# Altium project BuckConverter.PrjPcb
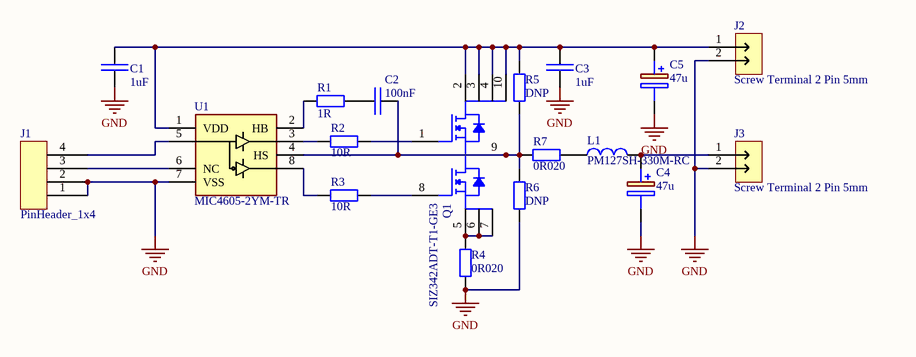
[diagram p0: BuckConverter.SchDoc]
1 sheet, 18 parts. Net scope: global (net labels, ports and power ports of the same name join across sheets).
Board file: PCB1.PcbDoc

## Sheet BuckConverter.SchDoc
size A4; SheetNumber: 1; SheetTotal: 1

### Parts
C1  1uF  [CAP_SM0805_YAGEOCC2_N]
C2  100nF  [CAP_SM0603_YAGEOCC2_N]
C3  1uF  [CAP_SM0805_YAGEOCC2_N]
C4  47u  [CAPAE7366X61N]
C5  47u  [CAPAE7366X61N]
J1  PinHeader_1x4  [PinHeader_1x4_2.54mm]
J2  Screw Terminal 2 Pin 5mm  [TB00250002BE]
J3  Screw Terminal 2 Pin 5mm  [TB00250002BE]
L1  PM127SH-330M-RC  [PM127SH330MRC]
Q1  SIZ342ADT-T1-GE3  [SIZ342ADT-T1-GE3]
R1  1R  [RES_SM0603_YAGEORC_N]
R2  10R  [RES_SM0603_YAGEORC_N]
R3  10R  [RES_SM0603_YAGEORC_N]
R4  0R020  [MSMA2512R0200FGN]
R5  DNP  [RES_SM0603_YAGEORC_N]
R6  DNP  [RES_SM0603_YAGEORC_N]
R7  0R020  [MSMA2512R0200FGN]
U1  MIC4605-2YM-TR  [SOIC127P600X163-8N]

### Nets
GND: C1.2 C3.2 C4.2(-) C5.2(-) J1.1 J1.2 J2.2 J3.2 R4.1 R6.1 U1.7(VSS)
NetC1_1: C1.1 C3.1 C5.1(+) J2.1 Q1.2(D) Q1.3(D) Q1.4(D) Q1.10(D) R5.2 U1.1(VDD)
NetC2_1: C2.1 R1.2
NetC2_2: C2.2 Q1.9(D) R5.1 R6.2 R7.2 U1.4(HS)
NetC4_1: C4.1(+) J3.1 L1.2
NetJ1_3: J1.3 U1.6(NC)
NetJ1_4: J1.4 U1.5(PWM)
NetL1_1: L1.1 R7.1
NetQ1_1: Q1.1(G1) R2.2
NetQ1_5: Q1.5(D) Q1.6(D) Q1.7(D) R4.2
NetQ1_8: Q1.8(G2) R3.2
NetR1_1: R1.1 U1.2(HB)
NetR2_1: R2.1 U1.3(HO)
NetR3_1: R3.1 U1.8(LO)

### Library data of the parts
C1 C3 = CC0805KKX7R8BB105: CAP 1uF SM0805 X7R 25V YAGEO CC2; Tolerance (%): 10; Voltage Rating (Volts): 25; Category: Capacitor; Manufacturer: Yageo; Manufacturer Part Number: CC0805KKX7R8BB105; Package: 0805; Value: 1uF; ComponentLink1URL: http://www.yageo.com; ComponentLink1Description: Manufacturer Website; Supplier 1: Farnell; Supplier Part Number 1: 1458903; Supplier 2: Digi-Key; Supplier Part Number 2: 311-1456-1-ND; Supplier 3: Mouser; Supplier Part Number 3: 603-CC805KKX7R8BB105
C2 = CC0603KRX7R9BB104: CAP 100nF SM0603 X7R 50V YAGEO CC2; Tolerance (%): 10; Voltage Rating (Volts): 50; Category: Capacitor; Manufacturer: Yageo; Manufacturer Part Number: CC0603KRX7R9BB104; Package: 0603; Value: 100nF; ComponentLink1URL: http://www.yageo.com; ComponentLink1Description: Manufacturer Website; Supplier 1: Farnell; Supplier Part Number 1: 1362556; Supplier 2: Mouser; Supplier Part Number 2: 603-CC603KRX7R9BB104
C4 C5 = EEE-FK1E470P: Aluminium Electrolytic Capacitors - SMD 47uF 25V; Value: 47u; Supplier 1: Mouser; Supplier Part Number 1: 667-EEE-FK1E470P; Supplier 2: Digi-Key; Supplier Part Number 2: PCE3804CT-ND; Supplier 3: Digi-Key; Supplier Part Number 3: PCE3804DKR-ND
J1 = PinHeader_1x4_2.54mm: PinHeader_1x4 2.54mm Pitch
J2 J3 = TB00250002BE: Fixed Terminal Blocks Terminal block, screw type, 5.00, horizontal, 2 poles, CUI Blue, slotted screw, PCB mount
L1 = PM127SH-330M-RC: Bourns PM127SH Series Shielded Wire-wound SMD Inductor with a Ferrite Core, 33 uH +/-20% Wire-Wound 3.5A Idc Q:28; Geometry.Height: 8mm; Mouser Part Number: 542-PM127SH-330M-RC; Mouser Price/Stock: https://www.mouser.co.uk/ProductDetail/Bourns/PM127SH-330M-RC?qs=eR5JJ6cMb%252Bbm7NbWn3468w%3D%3D; Manufacturer_Name: Bourns; Manufacturer_Part_Number: PM127SH-330M-RC; Datasheet Link: https://www.bourns.com/docs/Product-Datasheets/pm127sh_series.pdf; Supplier 1: Digi-Key; Supplier Part Number 1: PM127SH-330M-RCCT-ND; Supplier 2: Digi-Key; Supplier Part Number 2: PM127SH-330M-RCDKR-ND; Supplier 3: Mouser; Supplier Part Number 3: 542-PM127SH-330M-RC
Q1 = SIZ342ADT-T1-GE3: MOSFET 30V Vds 20V Vgs PowerPAIR 3 x 3; Manufacturer_Name: Vishay Semiconductors; Geometry.Height: 0.8mm; Mouser Part Number: 78-SIZ342ADT-T1-GE3; Manufacturer_Part_Number: SIZ342ADT-T1-GE3; Datasheet Link: https://www.vishay.com/doc?76711; Supplier 1: Mouser; Supplier Part Number 1: 78-SIZ342ADT-T1-GE3
R1 = RC0603FR-071RL: RES 1R SM0603YAGEO RC_L; Manufacturer: Yageo; Manufacturer Part Number: RC0805FR-0710RL; Power (Watts): 0.125; Resistance (Ohms): 10; Tolerance (%): 1; Category: Resistor; Package: 0805; Value: 1R; ComponentLink1Description: Manufacturer Website; ComponentLink1URL: http://www.yageo.com; Supplier 1: Digi-Key; Supplier Part Number 1: 311-1.00HRCT-ND; Supplier 2: Digi-Key; Supplier Part Number 2: 311-1.00HRDKR-ND; Supplier 3: Mouser; Supplier Part Number 3: 603-RC0603FR-071RL
R2 R3 = RC0603FR-0710RL: RES 10R SM0603 YAGEO RC_L; Power (Watts): 0.1; Resistance (Ohms): 10; Tolerance (%): 1; Category: Resistor; Manufacturer: Yageo; Manufacturer Part Number: RC0603FR-0710RL; Package: 0603; Value: 10R; Supplier Part Number 1: 9238247; Supplier 1: Farnell; ComponentLink1URL: http://www.yageo.com; ComponentLink1Description: Manufacturer Website; Supplier 2: Digi-Key; Supplier Part Number 2: 311-10.0HRCT-ND
R4 R7 = MSMA2512R0200FGN: RES SM0603YAGEO RC_L; Value: 0R020; Supplier 1: Digi-Key; Supplier Part Number 1: 283-MSMA2512R0200FGNCT-ND; Supplier 2: Digi-Key; Supplier Part Number 2: 283-MSMA2512R0200FGNDKR-ND; Supplier 3: Mouser; Supplier Part Number 3: 504-MSMA2512R0200FGN
R5 R6 = Resistor: RES SM0603YAGEO RC_L; Manufacturer: Yageo; Manufacturer Part Number: RC0805FR-0710RL; Power (Watts): 0.125; Resistance (Ohms): 10; Tolerance (%): 1; Category: Resistor; Package: 0805; Value: DNP; ComponentLink1Description: Manufacturer Website; ComponentLink1URL: http://www.yageo.com; Supplier 1: Digi-Key; Supplier Part Number 1: 311-1.00HRCT-ND; Supplier 2: Digi-Key; Supplier Part Number 2: 311-1.00HRDKR-ND; Supplier 3: Mouser; Supplier Part Number 3: 603-RC0603FR-071RL
U1 = MIC4605-2YM-TR: Gate Drivers 85V Half Bridge MOSFET Driver; Manufacturer_Name: Microchip; Geometry.Height: 1.63mm; Mouser Part Number: 998-MIC4605-2YM-TR; Mouser Price/Stock: https://www.mouser.co.uk/ProductDetail/Microchip-Technology/MIC4605-2YM-TR?qs=U6T8BxXiZAVl8W1xjIUxZQ%3D%3D; Manufacturer_Part_Number: MIC4605-2YM-TR; Datasheet Link: http://www.microchip.com/mymicrochip/filehandler.aspx?ddocname=en579235; Supplier 1: Arrow Electronics; Supplier Part Number 1: MIC4605-2YM-TR; Supplier 2: Digi-Key; Supplier Part Number 2: 576-4463-1-ND; Supplier 3: Digi-Key; Supplier Part Number 3: 576-4463-6-ND; Supplier 4: Mouser; Supplier Part Number 4: 998-MIC4605-2YM-TR